# EAGLE schematic OSSI-1 EPS (EAGLE 6.5.0)

## Sheet 1 of 3
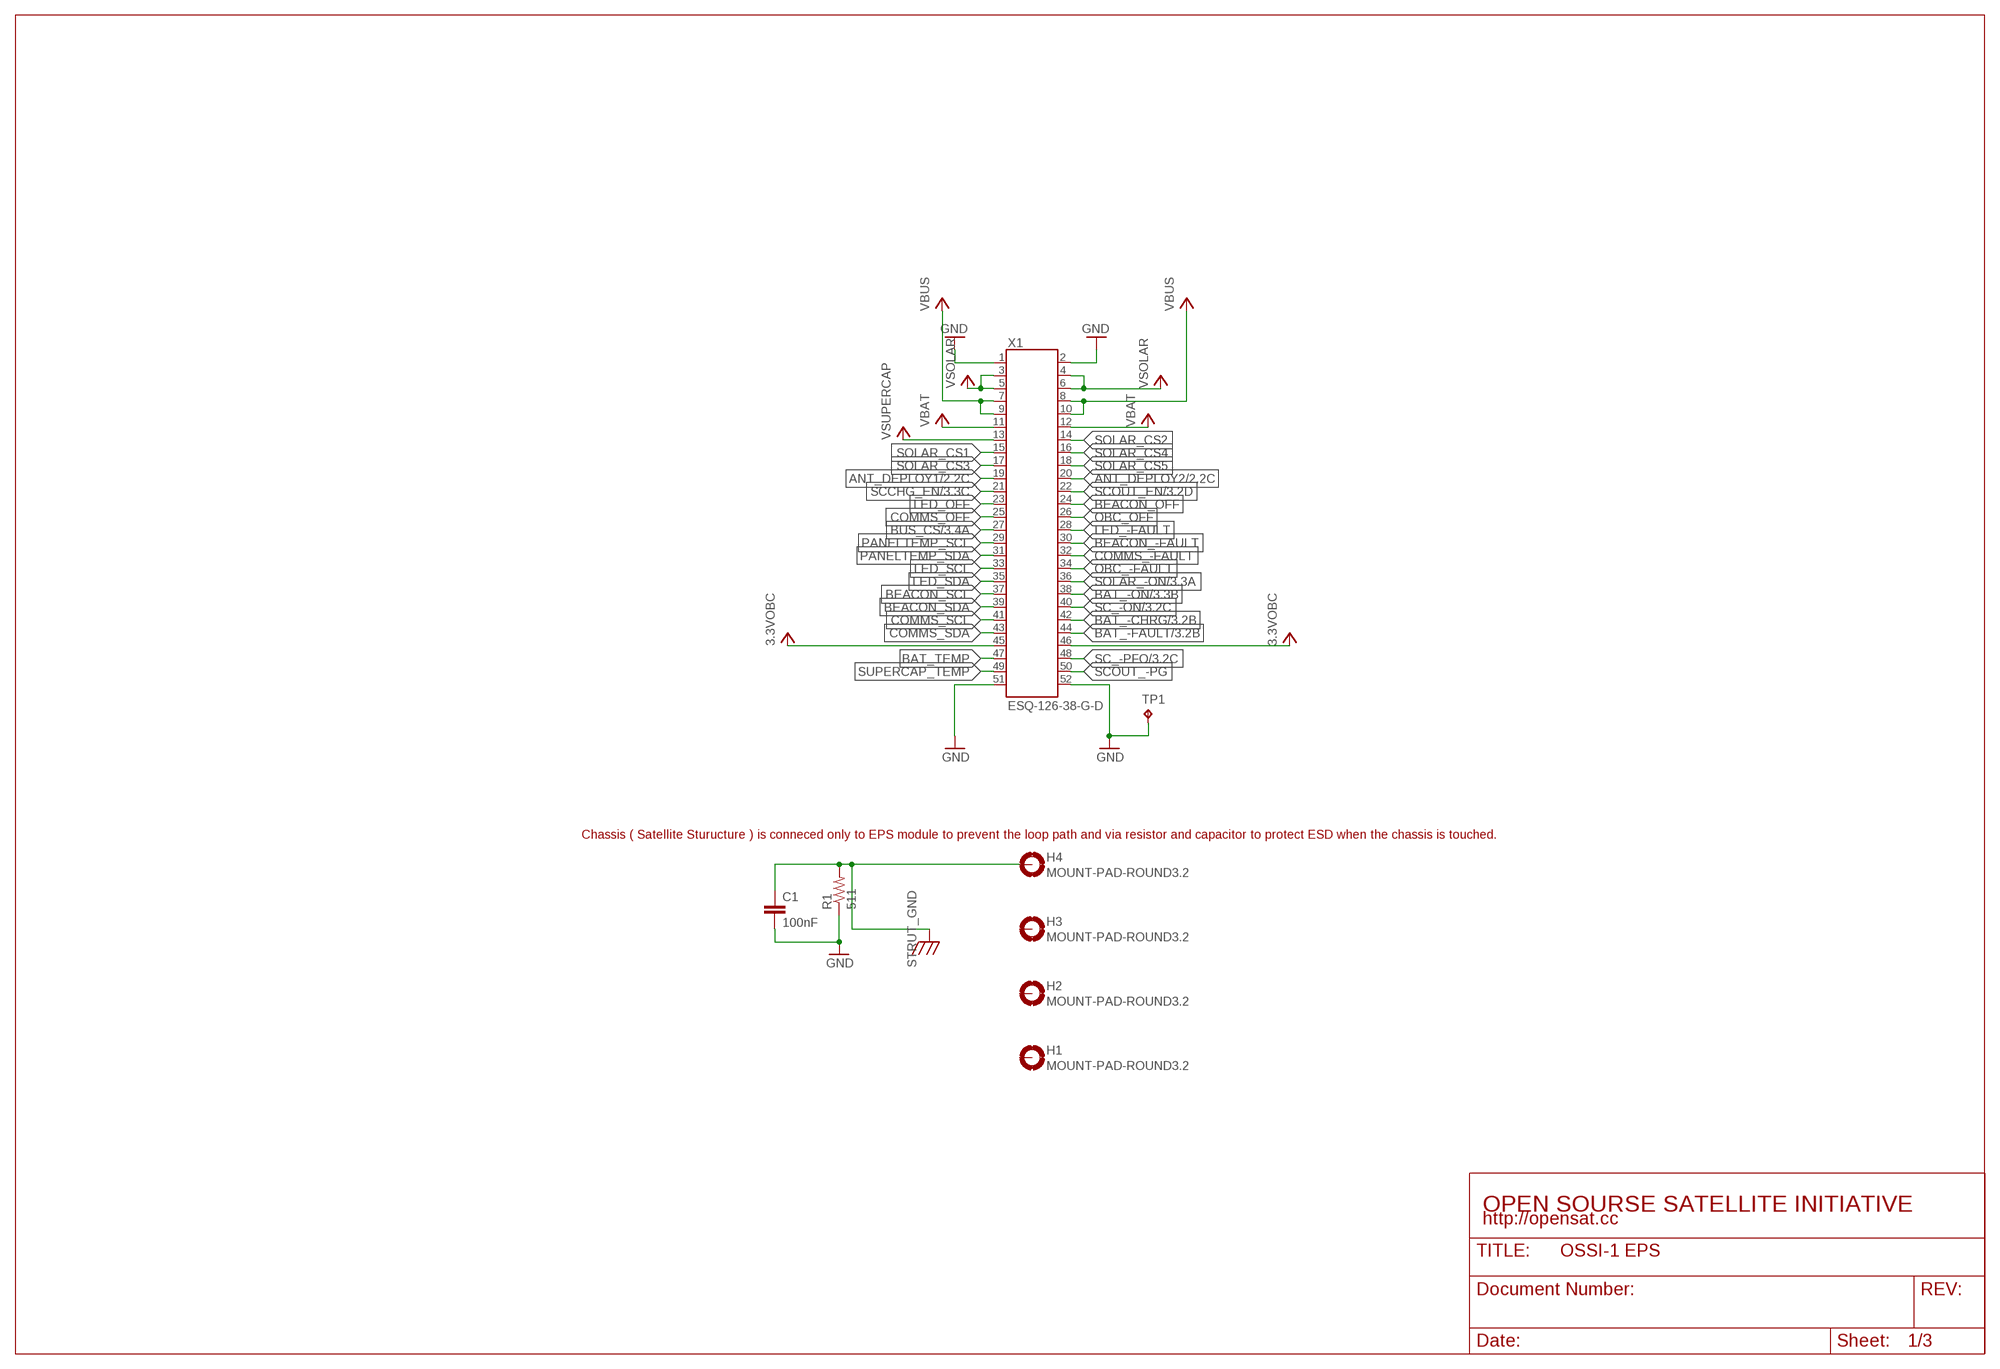
[diagram p0: schematic, sheet 1]

### Parts
C1  100nF  C0805(2012)  [C0805(2012)]
H1  MOUNT-PAD-ROUND3.2  [3.2-PAD-ROUND]
H2  MOUNT-PAD-ROUND3.2  [3.2-PAD-ROUND]
H3  MOUNT-PAD-ROUND3.2  [3.2-PAD-ROUND]
H4  MOUNT-PAD-ROUND3.2  [3.2-PAD-ROUND]
R1  511  RWSL1206  [WSL1206]
TP1  TP  [TP-13]
X1  ESQ-126-38-G-D  [ESQ-126-XX-X-D]

### Nets
3.3VOBC: X1.45 X1.46 ; also sheet 3
ANT_DEPLOY1: X1.19 ; also sheet 2
ANT_DEPLOY2: X1.20 ; also sheet 2
BAT_-CHRG: X1.42 ; also sheet 3
BAT_-FAULT: X1.44 ; also sheet 3
BAT_-ON: X1.38 ; also sheet 3
BAT_TEMP: X1.47
BEACON_-FAULT: X1.30
BEACON_OFF: X1.24
BEACON_SCL: X1.37
BEACON_SDA: X1.39
BUS_CS: X1.27 ; also sheet 3
COMMS_-FAULT: X1.32
COMMS_OFF: X1.25
COMMS_SCL: X1.41
COMMS_SDA: X1.43
GND: C1.2 R1.P$1 TP1.TP X1.1 X1.2 X1.51 X1.52 ; also sheet 2,3
LED_-FAULT: X1.28
LED_OFF: X1.23
LED_SCL: X1.33
LED_SDA: X1.35
OBC_-FAULT: X1.34
OBC_OFF: X1.26
PANELTEMP_SCL: X1.29
PANELTEMP_SDA: X1.31
SC_-ON: X1.40 ; also sheet 3
SC_-PFO: X1.48 ; also sheet 3
SCCHG_EN: X1.21 ; also sheet 3
SCOUT_-PG: X1.50
SCOUT_EN: X1.22 ; also sheet 3
SOLAR_-ON: X1.36 ; also sheet 3
SOLAR_CS1: X1.15
SOLAR_CS2: X1.14
SOLAR_CS3: X1.17
SOLAR_CS4: X1.16
SOLAR_CS5: X1.18
STRUT_GND: C1.1 H4.B3,2(MOUNT) R1.P$2
SUPERCAP_TEMP: X1.49
VBAT: X1.11 X1.12 ; also sheet 2,3
VBUS: X1.7 X1.8 X1.9 X1.10 ; also sheet 3
VSOLAR: X1.3 X1.4 X1.5 X1.6 ; also sheet 3
VSUPERCAP: X1.13 ; also sheet 3
Unconnected: H1.B3,2(MOUNT) H2.B3,2(MOUNT) H3.B3,2(MOUNT)

### Notes on the sheet
- Chassis ( Satellite Sturucture ) is conneced only to EPS module to prevent the loop path and via resistor and capacitor to protect ESD when the chassis is touched.
- OPEN SOURSE SATELLITE INITIATIVE
- http://opensat.cc

## Sheet 2 of 3
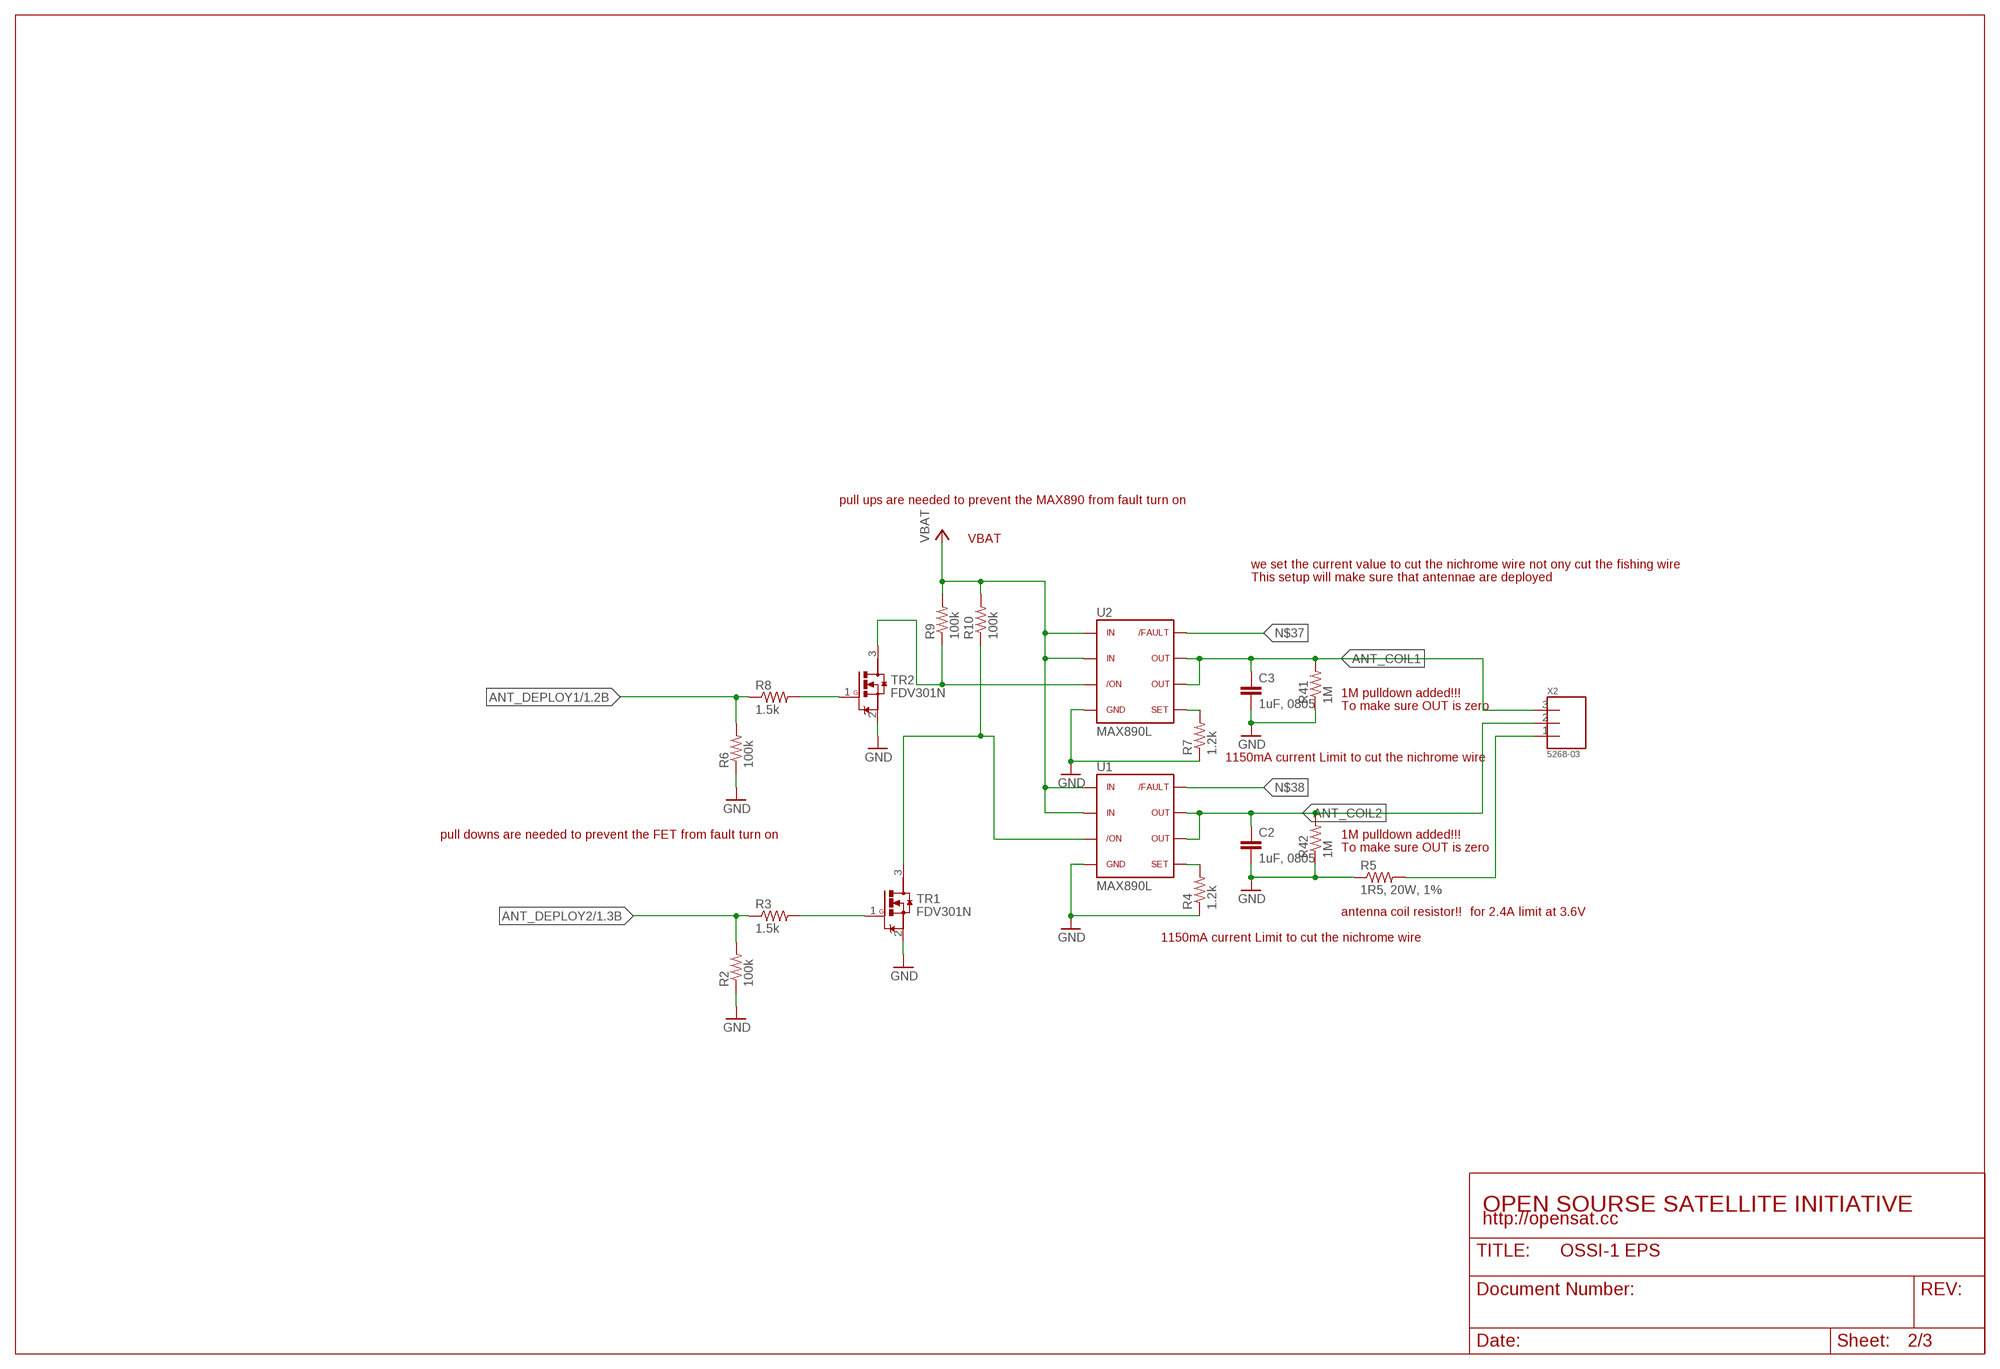
[diagram p1: schematic, sheet 2]

### Parts
C2  1uF, 0805  C0805(2012)  [C0805(2012)]
C3  1uF, 0805  C0805(2012)  [C0805(2012)]
R2  100k  R0603(1608)  [R0603(1608)]
R3  1.5k  R0603(1608)  [R0603(1608)]
R4  1.2k  R0603(1608)  [R0603(1608)]
R5  1R5, 20W, 1%  RPWR263S  [PWR263S-20]
R6  100k  R0603(1608)  [R0603(1608)]
R7  1.2k  R0603(1608)  [R0603(1608)]
R8  1.5k  R0603(1608)  [R0603(1608)]
R9  100k  R0603(1608)  [R0603(1608)]
R10  100k  R0603(1608)  [R0603(1608)]
R41  1M  R0603(1608)  [R0603(1608)]
R42  1M  R0603(1608)  [R0603(1608)]
TR1  FDV301N  [SOT23]
TR2  FDV301N  [SOT23]
U1  MAX890L  [SO8]
U2  MAX890L  [SO8]
X2  5268-03  [5268-03]

### Nets
ANT_COIL1: C3.1 R41.2 U2.6 U2.7 X2.3
ANT_COIL2: C2.1 R42.2 U1.6 U1.7 X2.2
ANT_DEPLOY1: R6.2 R8.1 ; also sheet 1
ANT_DEPLOY2: R2.2 R3.1 ; also sheet 1
GND: C2.2 C3.2 R2.1 R4.1 R5.P$1 R6.1 R7.1 R41.1 R42.1 TR1.2(S) TR2.2(S) U1.4 U2.4 ; also sheet 1,3
N$33: R3.2 TR1.1(G)
N$37: U2.8
N$38: U1.8
N$49: R8.2 TR2.1(G)
N$50: R9.1 TR2.3(D) U2.3
N$51: R10.1 TR1.3(D) U1.3
N$52: R7.2 U2.5
N$53: R4.2 U1.5
N$57: R5.P$2 X2.1
VBAT: R9.2 R10.2 U1.1 U1.2 U2.1 U2.2 ; also sheet 1,3

### Notes on the sheet
- pull ups are needed to prevent the MAX890 from fault turn on
- VBAT
- we set the current value to cut the nichrome wire not ony cut the fishing wire
- This setup will make sure that antennae are deployed
- 1M pulldown added!!!
- To make sure OUT is zero
- 1150mA current Limit to cut the nichrome wire
- pull downs are needed to prevent the FET from fault turn on | 1M pulldown added!!!
- To make sure OUT is zero
- antenna coil resistor!! | for 2.4A limit at 3.6V
- 1150mA current Limit to cut the nichrome wire
- OPEN SOURSE SATELLITE INITIATIVE
- http://opensat.cc

## Sheet 3 of 3
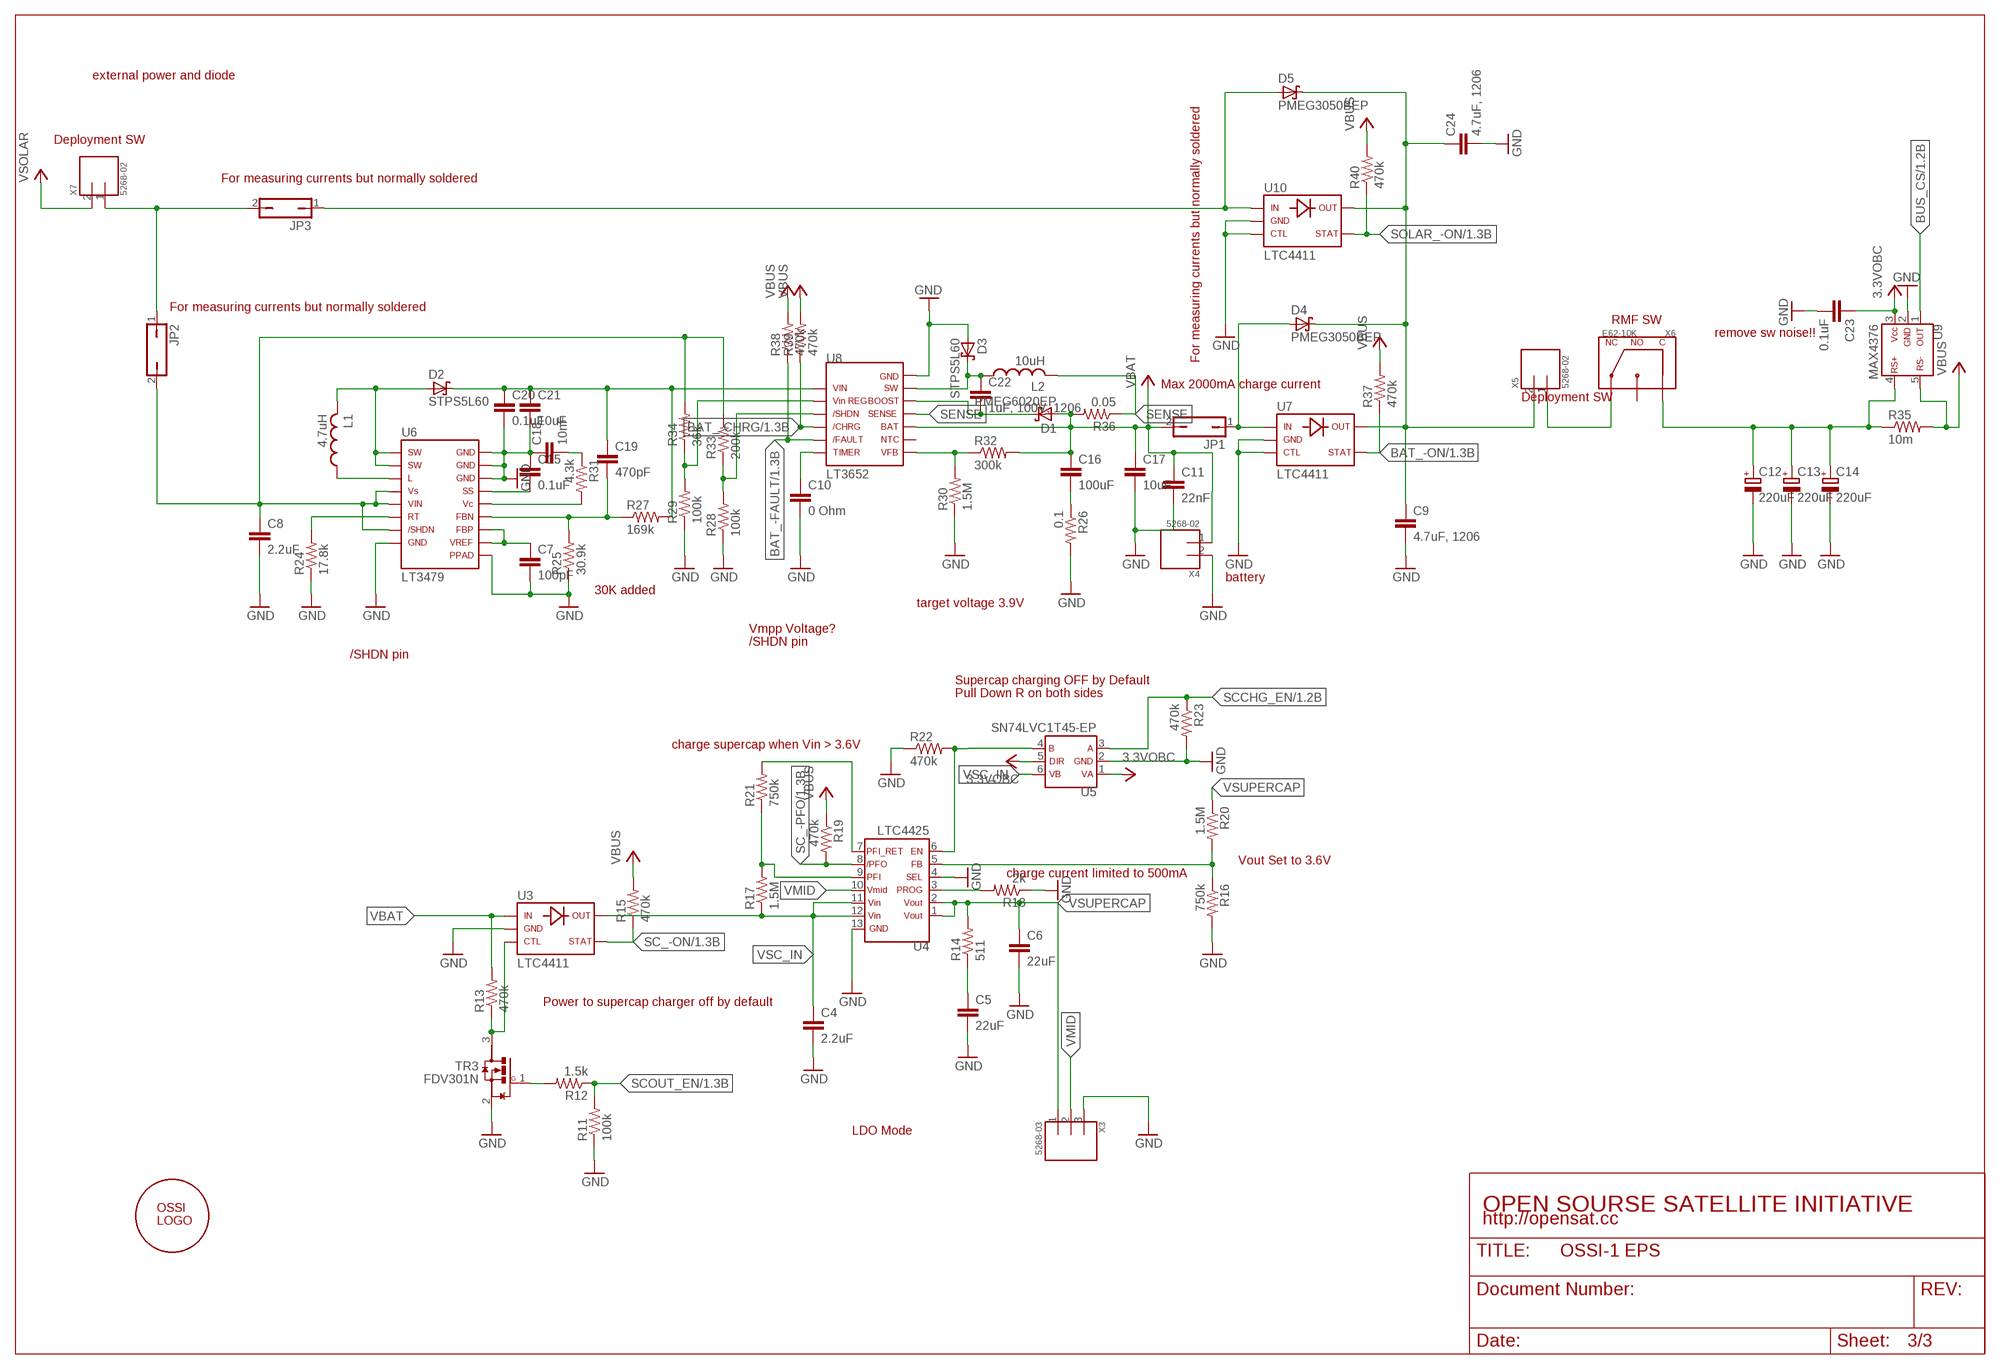
[diagram p2: schematic, sheet 3]

### Parts
C4  2.2uF  C1206(3216)-GCM31  [C1206-GCM31]
C5  22uF  C1210(3225)-GCM32  [C1210-GCM32]
C6  22uF  C1210(3225)-GCM32  [C1210-GCM32]
C7  100pF  C0603(1608)  [C0603(1608)]
C8  2.2uF  C1206(3216)-GCM31  [C1206-GCM31]
C9  4.7uF, 1206  C1206(3216)-GCM31  [C1206-GCM31]
C10  0 Ohm  C0603(1608)  [C0603(1608)]
C11  22nF  C0603(1608)  [C0603(1608)]
C12  220uF  C-TANTAL-Y  [C2917(7343)-Y]
C13  220uF  C-TANTAL-Y  [C2917(7343)-Y]
C14  220uF  C-TANTAL-Y  [C2917(7343)-Y]
C15  0.1uF  C0603(1608)  [C0603(1608)]
C16  100uF  C1210(3225)-TMK325  [C1210-TMK325]
C17  10uF  C1210(3225)-GCM32  [C1210-GCM32]
C18  10nF  C0603(1608)  [C0603(1608)]
C19  470pF  C0603(1608)  [C0603(1608)]
C20  0.1uF  C0603(1608)  [C0603(1608)]
C21  10uF  C1210(3225)-GCM32  [C1210-GCM32]
C22  1uF, 100V, 1206  C0805(2012)  [C0805(2012)]
C23  0.1uF  C0603(1608)  [C0603(1608)]
C24  4.7uF, 1206  C1206(3216)-GCM31  [C1206-GCM31]
D1  PMEG6020EP  [PMEG6020EP]
D2  STPS5L60  [STPS5L60]
D3  STPS5L60  [STPS5L60]
D4  PMEG3050BEP  PMEG6020EP  [PMEG6020EP]
D5  PMEG3050BEP  PMEG6020EP  [PMEG6020EP]
JP1  JP1Q  [JP1]
JP2  JP1Q  [JP1]
JP3  JP1Q  [JP1]
L1  4.7uH  LRLF7030  [RLF7030]
L2  10uH  LRLF12545  [RLF12545]
R11  100k  R0603(1608)  [R0603(1608)]
R12  1.5k  R0603(1608)  [R0603(1608)]
R13  470k  R0603(1608)  [R0603(1608)]
R14  511  RWSL1206  [WSL1206]
R15  470k  R0603(1608)  [R0603(1608)]
R16  750k  R0603(1608)  [R0603(1608)]
R17  1.5M  R0603(1608)  [R0603(1608)]
R18  2k  R0603(1608)  [R0603(1608)]
R19  470k  R0603(1608)  [R0603(1608)]
R20  1.5M  R0603(1608)  [R0603(1608)]
R21  750k  R0603(1608)  [R0603(1608)]
R22  470k  R0603(1608)  [R0603(1608)]
R23  470k  R0603(1608)  [R0603(1608)]
R24  17.8k  R0603(1608)  [R0603(1608)]
R25  30.9k  R0603(1608)  [R0603(1608)]
R26  0.1  RWSL1206  [WSL1206]
R27  169k  R0603(1608)  [R0603(1608)]
R28  100k  R0603(1608)  [R0603(1608)]
R29  100k  R0603(1608)  [R0603(1608)]
R30  1.5M  R0603(1608)  [R0603(1608)]
R31  4.3k  R0603(1608)  [R0603(1608)]
R32  300k  R0603(1608)  [R0603(1608)]
R33  200k  R0603(1608)  [R0603(1608)]
R34  36k  R0603(1608)  [R0603(1608)]
R35  10m  RWSL1206  [WSL1206]
R36  0.05  RWSL1206  [WSL1206]
R37  470k  R0603(1608)  [R0603(1608)]
R38  470k  R0603(1608)  [R0603(1608)]
R39  470k  R0603(1608)  [R0603(1608)]
R40  470k  R0603(1608)  [R0603(1608)]
TR3  FDV301N  [SOT23]
U3  LTC4411  [TSOT23-5]
U4  LTC4425  [MSE]
U5  SN74LVC1T45-EP  [SOT-6DCK]
U6  LT3479  [TSSOP16-FE]
U7  LTC4411  [TSOT23-5]
U8  LT3652  [MSE]
U9  MAX4376  [SOT23-5DBV]
U10  LTC4411  [TSOT23-5]
U$1  OSSILOGORECT  [OSSILOGORECT1005]
X3  5268-03  [5268-03]
X4  5268-02  [5628-02]
X5  5268-02  [5628-02]
X6  E62-10K  [E62-10K]
X7  5268-02  [5628-02]

### Nets
3.3VOBC: C23.1 U5.1 U5.5 U9.3 ; also sheet 1
BAT_-CHRG: R39.1 U8.4 ; also sheet 1
BAT_-FAULT: R38.1 U8.5 ; also sheet 1
BAT_-ON: R37.1 U7.P$4 ; also sheet 1
BUS_CS: U9.1 ; also sheet 1
GND: C4.P$2 C5.P$2 C6.P$2 C7.2 C8.P$2 C9.P$2 C10.2 C11.2 C12.2(-) C13.2(-) C14.2(-) C15.1 C17.P$2 C18.1 C20.2 C21.P$2 C23.2 C24.P$2 D3.A R11.1 R16.2 R18.1 R22.1 R23.2 R24.1 R25.1 R26.P$2 R28.1 R29.1 R30.1 TR3.2(S) U3.P$2 U4.4 U4.13 U5.2 U6.8 U6.14 U6.15 U6.16 U6.PPAD U7.P$2 U7.P$3 U8.13 U9.2 U10.P$2 U10.P$3 X3.3 X4.2 ; also sheet 1,2
N$1: L1.P$1 U6.3
N$2: R29.2 R34.1 U8.2
N$3: C19.1 C20.1 C21.P$1 D2.C R27.2 U8.1
N$4: C16.P$2 R26.P$1
N$5: C15.2 U6.13
N$6: D2.A L1.P$2 U6.1 U6.2
N$7: C18.2 R31.1
N$8: R31.2 U6.12
N$9: C19.2 R25.2 R27.1 U6.11
N$10: C7.1 U6.9 U6.10
N$11: R24.2 U6.6
N$12: R28.2 R33.1 U8.3
N$13: C22.2 D1.C U8.11
N$14: R16.1 R20.2 U4.5
N$16: C22.1 D3.C L2.P$1 U8.12
N$17: R30.2 R32.1 U8.7
N$18: C9.P$1 C24.P$1 D4.C D5.C U7.P$5 U10.P$5 X5.2
N$19: C10.1 U8.6
N$20: R22.2 U4.6 U5.4
N$21: C5.P$1 R14.P$1
N$22: R13.1 TR3.3(D) U3.P$3
N$23: R12.2 TR3.1(G)
N$24: C12.1(+) C13.1(+) C14.1(+) R35.P$1 U9.4 X6.C
N$29: R17.2 R21.1 U4.9
N$31: R21.2 U4.7
N$39: D5.A JP3.1 U10.P$1
N$40: R18.2 U4.3
N$42: D4.A JP1.1 U7.P$1
N$44: C8.P$1 JP2.2 R33.2 R34.2 U6.4 U6.5 U6.7
N$46: JP2.1 JP3.2 X7.1
N$54: X5.1 X6.NC
SC_-ON: R15.1 U3.P$4 ; also sheet 1
SC_-PFO: R19.2 U4.8 ; also sheet 1
SCCHG_EN: R23.1 U5.3 ; also sheet 1
SCOUT_EN: R11.2 R12.1 ; also sheet 1
SENSE: L2.P$2 R36.P$1 U8.10
SOLAR_-ON: R40.1 U10.P$4 ; also sheet 1
VBAT: C11.1 C16.P$1 C17.P$1 D1.A JP1.2 R13.2 R32.2 R36.P$2 U3.P$1 U8.9 X4.1 ; also sheet 1,2
VBUS: R15.2 R19.1 R35.P$2 R37.2 R38.2 R39.2 R40.2 U9.5 ; also sheet 1
VMID: U4.10 X3.2
VSC_IN: C4.P$1 R17.1 U3.P$5 U4.11 U4.12 U5.6
VSOLAR: X7.2 ; also sheet 1
VSUPERCAP: C6.P$1 R14.P$2 R20.1 U4.1 U4.2 X3.1 ; also sheet 1
Unconnected: U8.8 X6.NO

### Notes on the sheet
- external power and diode
- Deployment SW
- For measuring currents but normally soldered
- For measuring currents but normally soldered
- RMF SW
- remove sw noise!!
- For measuring currents but normally soldered
- Max 2000mA charge current
- Deployment SW
- battery
- 30K added
- target voltage 3.9V
- Vmpp Voltage?
- /SHDN pin
- /SHDN pin
- Supercap charging OFF by Default
- Pull Down R on both sides
- charge supercap when Vin > 3.6V
- Vout Set to 3.6V
- charge current limited to 500mA
- Power to supercap charger off by default
- LDO Mode
- OPEN SOURSE SATELLITE INITIATIVE
- http://opensat.cc

## Library data of the parts
C1-C11 C15-C24 = OSSI:C
C12-C14 = OSSI:C-TANTAL-Y: TAJY227K010RNJ Taltal Capacitor manufacture: AVX 2917(7343)
D1 D4 D5 = OSSI:PMEG6020EP
D2 D3 = OSSI:STPS5L60: STPS5L60 If: 5A / Vrrm: 60V / Vf: 0.47V @ 5A
H1-H4 = OSSI:MOUNT-PAD-ROUND
JP1-JP3 = OSSI:JP1Q: JUMPER
L1 L2 = OSSI:L
R1-R42 = OSSI:R
TP1 = OSSI:TP
TR1-TR3 = OSSI:FDV301N: FDV301N Digital N channel - FET / Rdson = 5 Ohm / Vgs = 0.7~1.06V / Ids = 220mA
U1 U2 = OSSI:MAX890L: MAX 890L 1.2A, Current-Limited, High-Side P-Channel Switch with Thermal Shutdown BY MAXIM
U3 U7 U10 = OSSI:LTC4411: Linear Techonology LTC4411 ideal diode Small Regulated Forward Voltage (28mV) 2.6A Maximum Forward Current 2.6V to 5.5V Operating Range MOSFET based
U4 = OSSI:LTC4425: LTC4425 Linear SuperCap Charger With Current-Limited Ideal Diode and V/I Monitor
U5 = OSSI:SN74LVC1T45-EP: SN74LVC1T45-EP SINGLE-BIT DUAL-SUPPLY BUS TRANSCEIVER WITH CONFIGURABLE VOLTAGE TRANSLATION AND 3-STATE OUTPUTS
U6 = OSSI:LT3479: LT3479 inverting switching convertor Input Voltage Range: 2.5V to 24V 3A, 42V Internal Switch Efﬁciency Power Conversion: Up to 89% Soft-Start Frequency Set by External Resistor: 200kHz to 3.5MHz Protection Against Input Short Circuits and Hot Plugging
U8 = OSSI:LT3652: LT3652 Battery Charger Power Tracking 2A Battery Charger for Solar Power e Input Voltage Range: 4.95V to 32V (40V Abs Max) Programmable Charge Rate Up to 2A Programmable Float Voltage Up to 14.4V 1MHz Fixed Frequency
U9 = OSSI:MAX4376
U$1 = OSSI:OSSILOGO
X1 = OSSI:ESQ-126-: Samtec ESQ-126-XX-G-D Elevated Sockets Seires ESQ-126-37-G-D ESQ-126-38-G-D ESQ-126-39-G-D
X2 X3 = OSSI:5268-03
X4 X5 X7 = OSSI:5268-02
X6 = OSSI:E62-10K: Cherry E620-10K spdt sw for Remove Before Flight pin